# Altium schematic sheet sensors.SchDoc
size A3; DocumentNumber: 10; SheetNumber: 10; SheetTotal: 11; SheetDescription: Environmental Sensors
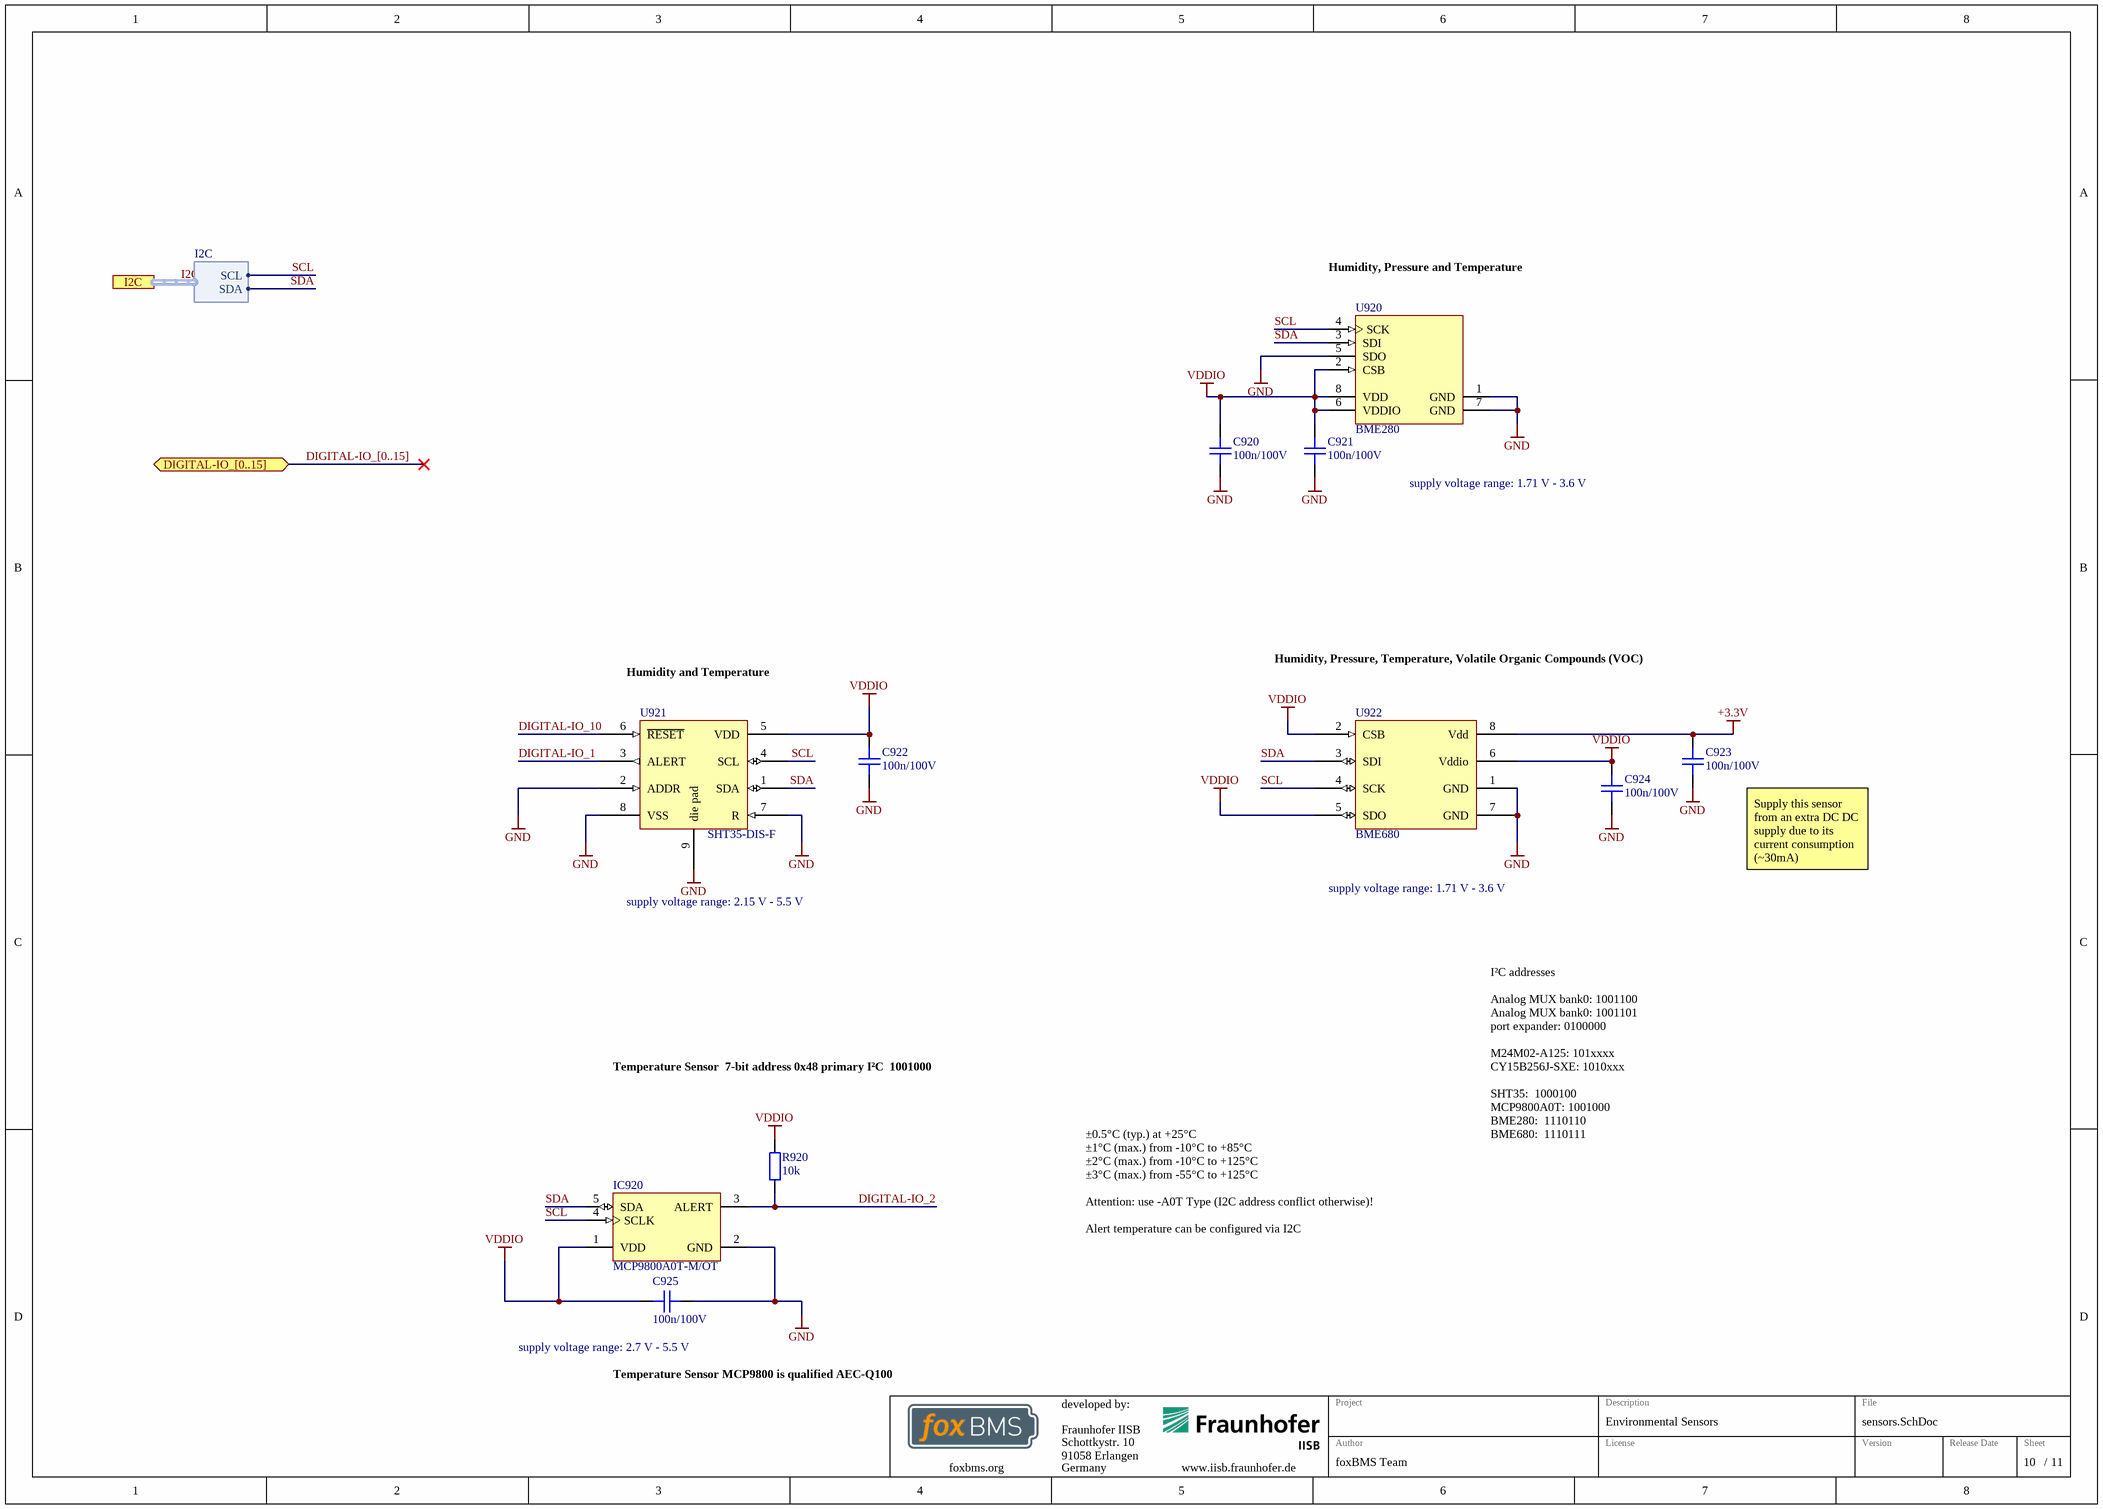
[diagram p0: sensors.SchDoc]

## Parts
C920  100n/100V  [CAPC1608X08N]
C921  100n/100V  [CAPC1608X08N]
C922  100n/100V  [CAPC1608X08N]
C923  100n/100V  [CAPC1608X08N]
C924  100n/100V  [CAPC1608X08N]
C925  100n/100V  [CAPC1608X08N]
IC920  MCP9800A0T-M/OT  [SOT-23-OT5_L]
R920  10k  [RESC1608X05N]
U920  BME280  [BOSC-BME280-8_V]
U921  SHT35-DIS-F  [SHT3X]
U922  BME680  [BME680]

## Ports
DIGITAL-IO_[0..15] (bidir), I2C (harness I2C)

## Harnesses
I2C: SCL, SDA

## Nets
+3.3V: C923.2 U922.8(Vdd)
GND: C920.1 C921.1 C922.1 C923.1 C924.1 C925.1 IC920.2(GND) U920.1(GND) U920.5(SDO) U920.7(GND) U921.2(ADDR) U921.7(R) U921.8(VSS) U921.9(die_pad) U922.1(GND) U922.7(GND)
VDDIO: C920.2 C921.2 C922.2 C924.2 C925.2 IC920.1(VDD) R920.2 U920.2(CSB) U920.6(VDDIO) U920.8(VDD) U921.5(VDD) U922.2(CSB) U922.5(SDO) U922.6(Vddio)
DIGITAL-IO_1: U921.3(ALERT)
DIGITAL-IO_2: IC920.3(ALERT) R920.1
DIGITAL-IO_10: U921.6(~{RESET})
SCL: IC920.4(SCLK) U920.4(SCK) U921.4(SCL) U922.4(SCK) ; port I2C.SCL  [project net I2C.SCL]
SDA: IC920.5(SDA) U920.3(SDI) U921.1(SDA) U922.3(SDI) ; port I2C.SDA  [project net I2C.SDA]

## Buses and harness runs
bus DIGITAL-IO_[0..15] = port DIGITAL-IO_[0..15]
harness I2C = port I2C

## Notes on the sheet
- Humidity, Pressure and Temperature
- supply voltage range: 1.71 V - 3.6 V
- Humidity and Temperature
- Humidity, Pressure, Temperature, Volatile Organic Compounds (VOC)
- supply voltage range: 2.15 V - 5.5 V
- Supply this sensor from an extra DC DC supply due to its current consumption (~30mA)
- Temperature Sensor
  7-bit address 0x48 primary I²C
  1001000
- ±0.5°C (typ.) at +25°C
  ±1°C (max.) from -10°C to +85°C
  ±2°C (max.) from -10°C to +125°C
  ±3°C (max.) from -55°C to +125°C
  Attention: use -A0T Type (I2C address conflict otherwise)!
  Alert temperature can be configured via I2C
- I²C addresses
  Analog MUX bank0:	1001100
  Analog MUX bank0:	1001101
  port expander:	0100000
  M24M02-A125:	101xxxx
  CY15B256J-SXE:	1010xxx
  SHT35:		1000100
  MCP9800A0T:	1001000
  BME280:		1110110
  BME680:		1110111
- (near C925) supply voltage range: 2.7 V - 5.5 V
- Temperature Sensor MCP9800 is qualified AEC-Q100
- Fraunhofer IISB
- Schottkystr. 10
- developed by:
- 91058 Erlangen
- Germany
- Author
- Project
- License
- Description
- File
- Version
- Release Date
- Sheet
- foxbms.org <https://foxbms.org>
- www.iisb.fraunhofer.de <https://www.iisb.fraunhofer.de/>
- foxBMS Team
- /

## Library data of the parts
C920-C925 = gen_C_ceramic_100n_100V_X7R_0603: MLCC; Capacitance: 100n; Rated Voltage: 100V; Dielectric: X7R; Case EIA: 0603; Case Metric: 1608; Automotive Qualified: True; PnP Package: 0603C; Part Number: gen_C_ceramic_100n_100V_X7R_0603; Supplier 1: Digikey; Supplier Part Number 1: 490-13420-1-ND; Supplier 2: Mouser; Supplier Part Number 2: 81-GCJ188R72A104KA1D
IC920 = CMP-0192-00211-1: 2-Wire High-Accuracy Temperature Sensor, Slave Address 000, 5-Pin SOT-23, -55°C to +125°C Temperature, Tape and Reel; PackageReference: SOT-23-OT5; PackageVersion: revBB, Aug-2009; DatasheetVersion: revD, Nov-2010; PackageDescription: 5-Lead Plastic Small Outline Transistor (OT) [SOT-23]; Code_IPC: SOT23-5
R920 = gen_R_10k_0603: SMD Resistor 10k 0603; Tolerance: 1%; Power: 0.1W; Case EIA: 0603; Case Metric: 1608; Maximum Working Voltage: 75V; PnP Package: 0603R; Automotive Qualified: True; Part Number: gen_R_10k_0603; Operating Temperature: -55°C - +155°C; Resistance: 10k; Series: E24, E96; PnP Value: 10k; Supplier 1: Farnell; Supplier Part Number 1: 2073349
U920 = BME280: Low power pressure, temperature & humidity sensor; Manufacturer: Bosch Sensortec; PnP Package: LGA; Automotive Qualified: False; Datasheet Version: Rev. 1.2, 10/2015; Datasheet URL: http://datasheet.octopart.com/BME280-Bosch-datasheet-58577763.pdf; Manufacturer URL: http://www.bosch-sensortec.com; Part Number: BME280; Part Name: BME280; Operating Temperature: -40°C - +85°C; ComponentLink1Description: Datasheet; ComponentLink1URL: https://ae-bst.resource.bosch.com/media/_tech/media/datasheets/BST-BME280-DS002.pdf; Supplier 1: Digikey; Supplier Part Number 1: 828-1063-1-ND; Supplier 2: Mouser; Supplier Part Number 2: 262-BME280
U921 = SHT35-DIS-F: Humidity/Temp Sensor, Digital, Dfn-8; Manufacturer: Sensirion; PnP Package: DFN; Automotive Qualified: True; Part Number: SHT35-DIS-F; Part Name: SHT35-DIS-F; Operating Temperature: -40°C - +125°C; ComponentLink1Description: Datasheet; ComponentLink1URL: http://www.farnell.com/datasheets/2756487.pdf; Supplier 1: Farnell; Supplier Part Number 1: 2886656; Supplier 2: Digikey; Supplier Part Number 2: 1649-1067-1-ND; Supplier 3: Mouser; Supplier Part Number 3: 403-SHT35-DIS-F
U922 = BME680: Low power gas, pressure, temperature & humidity sensor; Manufacturer: Bosch Sensortec; PnP Package: LGA; Automotive Qualified: False; Part Number: BME680; Part Name: BME680; Operating Temperature: -40°C - +85°C; ComponentLink1Description: Datasheet; ComponentLink1URL: https://ae-bst.resource.bosch.com/media/_tech/media/datasheets/BST-BME680-DS001.pdf; Supplier 1: Digikey; Supplier Part Number 1: 828-1077-1-ND; Supplier 2: Mouser; Supplier Part Number 2: 262-BME680